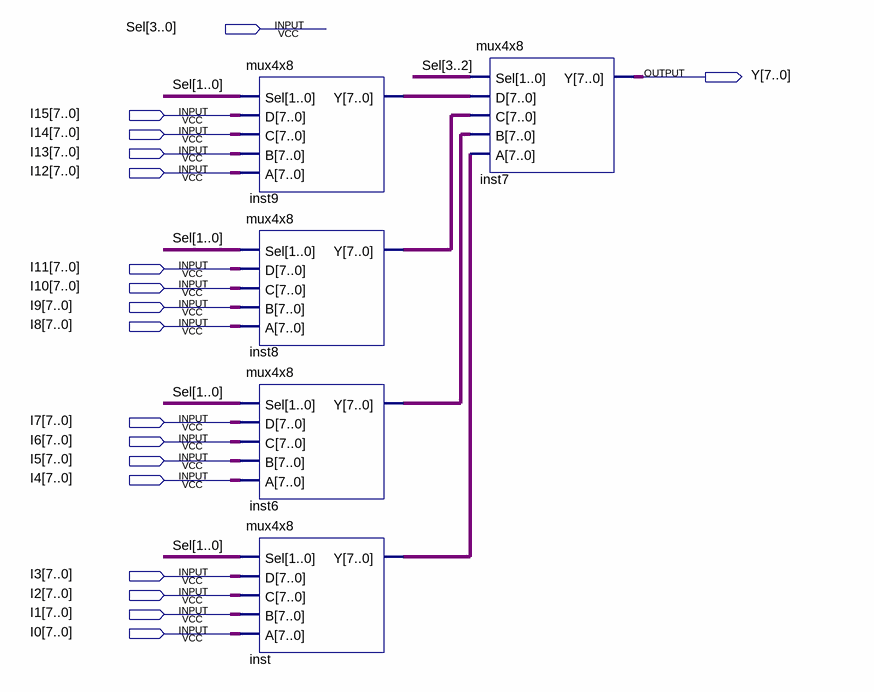
[diagram p0: schematic sheet]
// Quartus schematic mux16x8.bdf as structural Verilog: 5 symbols, 18 pins
module mux16x8 (
  input  [3:0] Sel,
  input  [7:0] I15,
  input  [7:0] I14,
  input  [7:0] I13,
  input  [7:0] I12,
  input  [7:0] I11,
  input  [7:0] I10,
  input  [7:0] I9,
  input  [7:0] I8,
  input  [7:0] I7,
  input  [7:0] I6,
  input  [7:0] I5,
  input  [7:0] I4,
  input  [7:0] I3,
  input  [7:0] I2,
  input  [7:0] I1,
  input  [7:0] I0,
  output [7:0] Y
);

  wire [7:0] inst6_y, inst8_y, inst9_y, inst_y;

  mux4x8 inst9 (.Sel(Sel[1:0]), .D(I15), .C(I14), .B(I13), .A(I12), .Y(inst9_y));
  mux4x8 inst8 (.Sel(Sel[1:0]), .D(I11), .C(I10), .B(I9), .A(I8), .Y(inst8_y));
  mux4x8 inst6 (.Sel(Sel[1:0]), .D(I7), .C(I6), .B(I5), .A(I4), .Y(inst6_y));
  mux4x8 inst (.Sel(Sel[1:0]), .D(I3), .C(I2), .B(I1), .A(I0), .Y(inst_y));
  mux4x8 inst7 (.Sel(Sel[3:2]), .D(inst9_y), .C(inst8_y), .B(inst6_y), .A(inst_y), .Y(Y));
endmodule
